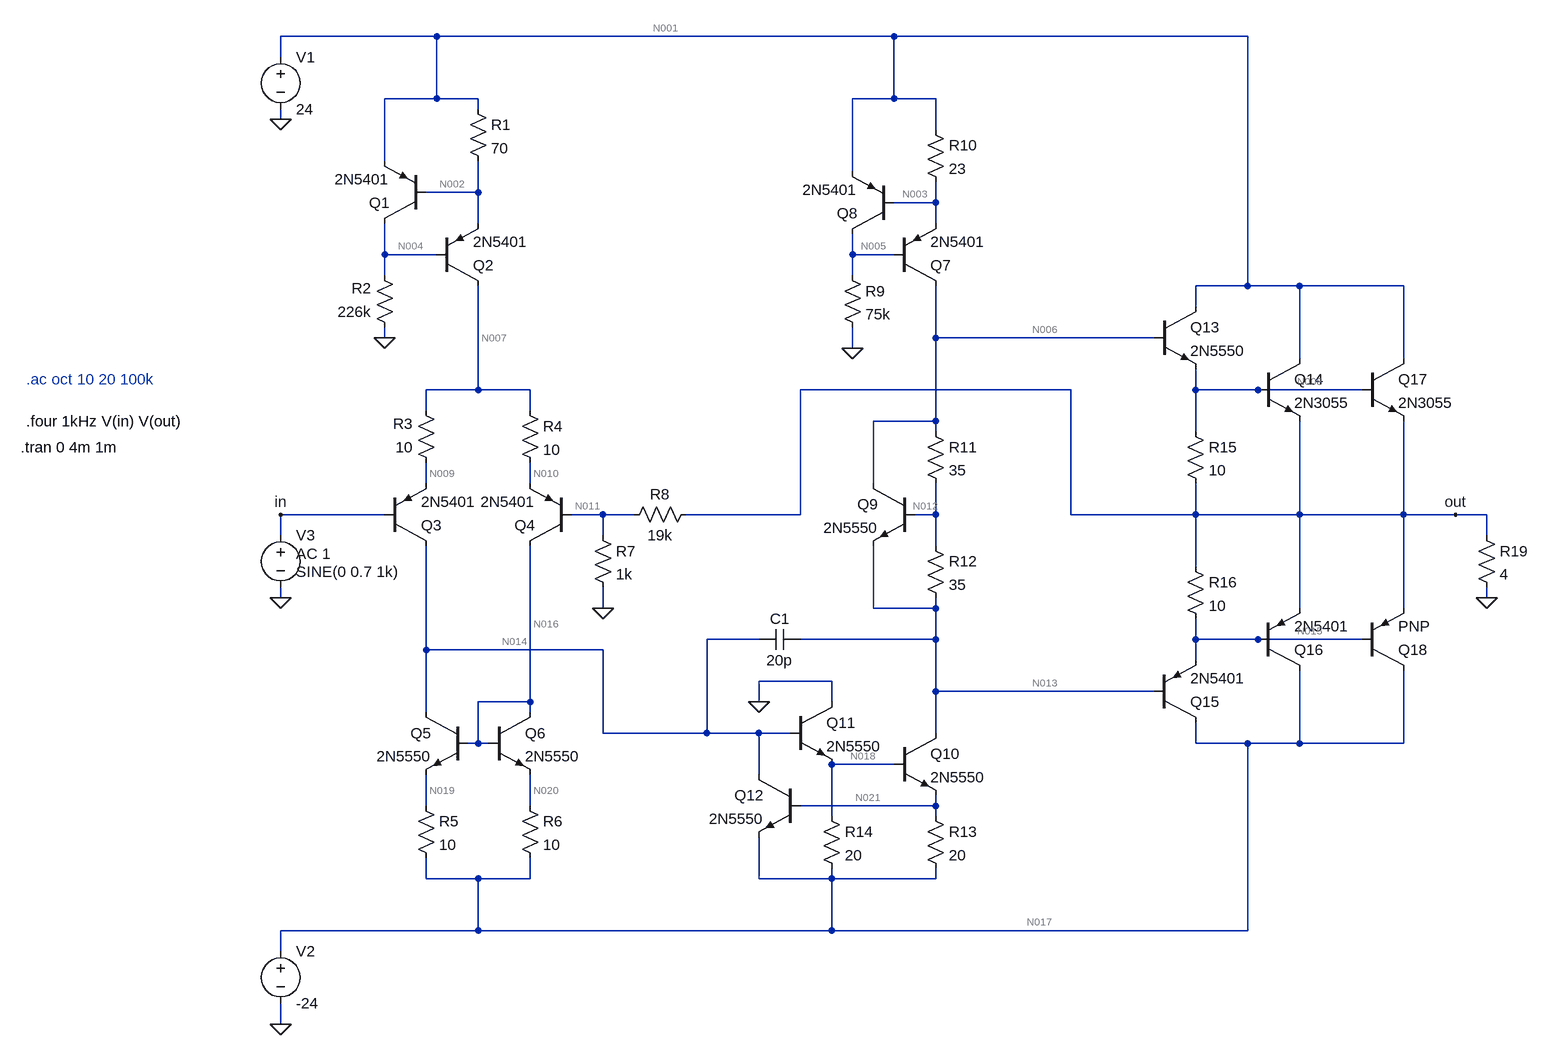
[diagram p0: schematic amp.asc]
amp.asc, the LTspice schematic file:
Version 4.1
SHEET 1 1880 1236
WIRE 96 -304 -144 -304
WIRE 800 -304 96 -304
WIRE 1344 -304 800 -304
WIRE -144 -272 -144 -304
WIRE 96 -208 96 -304
WIRE 96 -208 16 -208
WIRE 160 -208 96 -208
WIRE 800 -208 800 -304
WIRE 800 -208 736 -208
WIRE 864 -208 800 -208
WIRE 160 -192 160 -208
WIRE -144 -176 -144 -192
WIRE 864 -160 864 -208
WIRE 16 -112 16 -208
WIRE 736 -96 736 -208
WIRE 160 -64 160 -112
WIRE 160 -64 80 -64
WIRE 864 -48 864 -80
WIRE 864 -48 800 -48
WIRE 160 -16 160 -64
WIRE 864 -16 864 -48
WIRE 16 32 16 -16
WIRE 96 32 16 32
WIRE 736 32 736 0
WIRE 800 32 736 32
WIRE 16 64 16 32
WIRE 736 64 736 32
WIRE 1344 80 1344 -304
WIRE 1344 80 1264 80
WIRE 1424 80 1344 80
WIRE 1584 80 1424 80
WIRE 1264 112 1264 80
WIRE 16 160 16 144
WIRE 864 160 864 80
WIRE 1200 160 864 160
WIRE 736 176 736 144
WIRE 1424 192 1424 80
WIRE 1584 192 1584 80
WIRE 160 240 160 80
WIRE 160 240 80 240
WIRE 240 240 160 240
WIRE 1072 240 656 240
WIRE 1264 240 1264 208
WIRE 1360 240 1264 240
WIRE 1520 240 1360 240
WIRE 80 272 80 240
WIRE 240 272 240 240
WIRE 864 288 864 160
WIRE 864 288 768 288
WIRE 864 304 864 288
WIRE 1264 304 1264 240
WIRE 80 384 80 352
WIRE 240 384 240 352
WIRE 768 384 768 288
WIRE 16 432 -144 432
WIRE 352 432 304 432
WIRE 400 432 352 432
WIRE 656 432 656 240
WIRE 656 432 480 432
WIRE 864 432 864 384
WIRE 864 432 832 432
WIRE 1072 432 1072 240
WIRE 1264 432 1264 384
WIRE 1264 432 1072 432
WIRE 1424 432 1424 288
WIRE 1424 432 1264 432
WIRE 1584 432 1584 288
WIRE 1584 432 1424 432
WIRE 1664 432 1584 432
WIRE 1712 432 1664 432
WIRE -144 464 -144 432
WIRE 352 464 352 432
WIRE 1712 464 1712 432
WIRE 864 480 864 432
WIRE 1264 512 1264 432
WIRE -144 560 -144 544
WIRE 1712 560 1712 544
WIRE 352 576 352 544
WIRE 768 576 768 480
WIRE 864 576 864 560
WIRE 864 576 768 576
WIRE 1424 576 1424 432
WIRE 1584 576 1584 432
WIRE 592 624 512 624
WIRE 864 624 864 576
WIRE 864 624 656 624
WIRE 1264 624 1264 592
WIRE 1360 624 1264 624
WIRE 1520 624 1360 624
WIRE 80 640 80 480
WIRE 352 640 80 640
WIRE 1264 656 1264 624
WIRE 704 688 592 688
WIRE 864 704 864 624
WIRE 1200 704 864 704
WIRE 240 720 240 480
WIRE 240 720 160 720
WIRE 592 720 592 688
WIRE 704 720 704 688
WIRE 80 736 80 640
WIRE 240 736 240 720
WIRE 352 768 352 640
WIRE 512 768 512 624
WIRE 512 768 352 768
WIRE 592 768 512 768
WIRE 640 768 592 768
WIRE 864 768 864 704
WIRE 160 784 160 720
WIRE 160 784 144 784
WIRE 176 784 160 784
WIRE 1264 784 1264 752
WIRE 1344 784 1264 784
WIRE 1424 784 1424 672
WIRE 1424 784 1344 784
WIRE 1584 784 1584 672
WIRE 1584 784 1424 784
WIRE 800 816 704 816
WIRE 592 832 592 768
WIRE 80 880 80 832
WIRE 240 880 240 832
WIRE 864 880 864 864
WIRE 864 880 656 880
WIRE 704 896 704 816
WIRE 864 896 864 880
WIRE 80 992 80 960
WIRE 160 992 80 992
WIRE 240 992 240 960
WIRE 240 992 160 992
WIRE 592 992 592 928
WIRE 704 992 704 976
WIRE 704 992 592 992
WIRE 864 992 864 976
WIRE 864 992 704 992
WIRE 160 1072 160 992
WIRE 160 1072 -144 1072
WIRE 704 1072 704 992
WIRE 704 1072 160 1072
WIRE 1344 1072 1344 784
WIRE 1344 1072 704 1072
WIRE -144 1104 -144 1072
WIRE -144 1216 -144 1184
FLAG 16 160 0
FLAG 352 576 0
FLAG 736 176 0
FLAG 592 720 0
FLAG -144 -176 0
FLAG -144 1216 0
FLAG -144 560 0
FLAG 1712 560 0
FLAG 1664 432 out
FLAG -144 432 in
SYMBOL pnp 80 -16 R180
SYMATTR InstName Q1
SYMATTR Value 2N5401
SYMBOL res 144 -208 R0
SYMATTR InstName R1
SYMATTR Value 70
SYMBOL res 32 160 R180
WINDOW 0 36 76 Left 2
WINDOW 3 36 40 Left 2
SYMATTR InstName R2
SYMATTR Value 226k
SYMBOL res 96 368 R180
WINDOW 0 36 76 Left 2
WINDOW 3 36 40 Left 2
SYMATTR InstName R3
SYMATTR Value 10
SYMBOL res 224 256 R0
SYMATTR InstName R4
SYMATTR Value 10
SYMBOL pnp 16 480 M180
SYMATTR InstName Q3
SYMATTR Value 2N5401
SYMBOL pnp 304 480 R180
SYMATTR InstName Q4
SYMATTR Value 2N5401
SYMBOL npn 144 736 M0
SYMATTR InstName Q5
SYMATTR Value 2N5550
SYMBOL npn 176 736 R0
SYMATTR InstName Q6
SYMATTR Value 2N5550
SYMBOL res 64 864 R0
SYMATTR InstName R5
SYMATTR Value 10
SYMBOL res 224 864 R0
SYMATTR InstName R6
SYMATTR Value 10
SYMBOL res 336 448 R0
SYMATTR InstName R7
SYMATTR Value 1k
SYMBOL res 496 416 R90
WINDOW 0 0 56 VBottom 2
WINDOW 3 32 56 VTop 2
SYMATTR InstName R8
SYMATTR Value 19k
SYMBOL pnp 800 0 R180
SYMATTR InstName Q8
SYMATTR Value 2N5401
SYMBOL res 720 48 R0
SYMATTR InstName R9
SYMATTR Value 75k
SYMBOL res 848 -176 R0
SYMATTR InstName R10
SYMATTR Value 23
SYMBOL pnp 96 80 M180
SYMATTR InstName Q2
SYMATTR Value 2N5401
SYMBOL pnp 800 80 M180
SYMATTR InstName Q7
SYMATTR Value 2N5401
SYMBOL npn 832 384 M0
SYMATTR InstName Q9
SYMATTR Value 2N5550
SYMBOL res 848 288 R0
SYMATTR InstName R11
SYMATTR Value 35
SYMBOL res 848 464 R0
SYMATTR InstName R12
SYMATTR Value 35
SYMBOL npn 800 768 R0
SYMATTR InstName Q10
SYMATTR Value 2N5550
SYMBOL npn 640 720 R0
SYMATTR InstName Q11
SYMATTR Value 2N5550
SYMBOL npn 656 832 M0
SYMATTR InstName Q12
SYMATTR Value 2N5550
SYMBOL res 848 880 R0
SYMATTR InstName R13
SYMATTR Value 20
SYMBOL res 688 880 R0
SYMATTR InstName R14
SYMATTR Value 20
SYMBOL npn 1200 112 R0
SYMATTR InstName Q13
SYMATTR Value 2N5550
SYMBOL npn 1360 192 R0
SYMATTR InstName Q14
SYMATTR Value 2N3055
SYMBOL pnp 1200 752 M180
SYMATTR InstName Q15
SYMATTR Value 2N5401
SYMBOL pnp 1360 672 M180
SYMATTR InstName Q16
SYMATTR Value 2N5401
SYMBOL voltage -144 -288 R0
WINDOW 123 0 0 Left 0
WINDOW 39 0 0 Left 0
SYMATTR InstName V1
SYMATTR Value 24
SYMBOL voltage -144 1088 R0
WINDOW 123 0 0 Left 0
WINDOW 39 0 0 Left 0
SYMATTR InstName V2
SYMATTR Value -24
SYMBOL voltage -144 448 R0
WINDOW 3 24 72 Left 2
WINDOW 123 24 44 Left 2
WINDOW 39 0 0 Left 0
SYMATTR Value SINE(0 0.7 1k)
SYMATTR Value2 AC 1
SYMATTR InstName V3
SYMBOL res 1696 448 R0
SYMATTR InstName R19
SYMATTR Value 4
SYMBOL npn 1520 192 R0
SYMATTR InstName Q17
SYMATTR Value 2N3055
SYMBOL pnp 1520 672 M180
SYMATTR InstName Q18
SYMBOL res 1248 288 R0
SYMATTR InstName R15
SYMATTR Value 10
SYMBOL res 1248 496 R0
SYMATTR InstName R16
SYMATTR Value 10
SYMBOL cap 656 608 R90
WINDOW 0 0 32 VBottom 2
WINDOW 3 32 32 VTop 2
SYMATTR InstName C1
SYMATTR Value 20p
TEXT -536 224 Left 2 ;.ac oct 10 20 100k
TEXT -544 328 Left 2 !.tran 0 4m 1m
TEXT -536 288 Left 2 !.four 1kHz V(in) V(out)

The netlist it stands for:
* amp.asc
Q1 N004 N002 N001 0 2N5401
R1 N001 N002 70
R2 0 N004 226k
R3 N009 N007 10
R4 N007 N010 10
Q3 N014 in N009 0 2N5401
Q4 N016 N011 N010 0 2N5401
Q5 N014 N016 N019 0 2N5550
Q6 N016 N016 N020 0 2N5550
R5 N019 N017 10
R6 N020 N017 10
R7 N011 0 1k
R8 out N011 19k
Q8 N005 N003 N001 0 2N5401
R9 N005 0 75k
R10 N001 N003 23
Q2 N007 N004 N002 0 2N5401
Q7 N006 N005 N003 0 2N5401
Q9 N006 N012 N013 0 2N5550
R11 N006 N012 35
R12 N012 N013 35
Q10 N013 N018 N021 0 2N5550
Q11 0 N014 N018 0 2N5550
Q12 N014 N021 N017 0 2N5550
R13 N021 N017 20
R14 N018 N017 20
Q13 N001 N006 N008 0 2N5550
Q14 N001 N008 out 0 2N3055
Q15 N017 N013 N015 0 2N5401
Q16 N017 N015 out 0 2N5401
V1 N001 0 24
V2 N017 0 -24
V3 in 0 SINE(0 0.7 1k) AC 1
R19 out 0 4
Q17 N001 N008 out 0 2N3055
Q18 N017 N015 out 0 PNP
R15 N008 out 10
R16 out N015 10
C1 N013 N014 20p
.model NPN NPN
.model PNP PNP
.lib standard.bjt
* .ac oct 10 20 100k
.tran 0 4m 1m
.four 1kHz V(in) V(out)
.backanno
.end

* Results of the author's LTspice run, read from the files saved beside the schematic
* Operating Point, zero values left out:
*   V(n002) = 23.44 V
*   V(n009) = 667.5 mV
*   V(n007) = 708.9 mV
*   V(n014) = -21.91 V
*   V(n011) = 6.91 mV
*   V(n020) = -23.96 V
*   V(n017) = -24 V
*   V(n005) = 22.7 V
*   V(n012) = -1.088 V
*   V(n018) = -22.71 V
*   V(n015) = -1.063 V
*   V(n004) = 22.76 V
*   V(n001) = 24 V
*   V(n010) = 671.5 mV
*   V(n016) = -23.24 V
*   V(n019) = -23.96 V
*   V(out) = -355.1 mV
*   V(n003) = 23.42 V
*   V(n006) = -357.9 mV
*   V(n013) = -1.816 V
*   V(n021) = -23.48 V
*   V(n008) = -355.1 mV
*   I(R2) = -100.7 µA
*   Ic(Q12) = 1.197 µA
*   Ib(Q12) = 29.92 nA
*   Ie(Q12) = -1.227 µA
*   Ic(Q13) = 24.36 pA
*   Ib(Q13) = -24.36 pA
*   Ic(Q17) = 32.63 nA
*   Ib(Q17) = -8.934 nA
*   Ie(Q17) = -23.7 nA
*   I(R15) = 17.87 nA
*   Ic(Q1) = -45.25 µA
*   Ib(Q1) = -469.3 nA
*   Ie(Q1) = 45.72 µA
*   I(R6) = 3.681 mA
*   Ic(Q8) = -119.7 µA
*   Ib(Q8) = -1.162 µA
*   Ie(Q8) = 120.8 µA
*   Ic(Q9) = 4.197 mA
*   Ib(Q9) = 37.58 µA
*   Ie(Q9) = -4.235 mA
*   Ic(Q3) = -4.106 mA
*   Ib(Q3) = -28.98 µA
*   Ie(Q3) = 4.135 mA
*   I(V2) = 185.9 mA
*   I(R12) = 20.81 mA
*   I(R4) = 3.74 mA
*   Ic(Q5) = 3.668 mA
*   Ib(Q5) = 33.03 µA
*   Ie(Q5) = -3.701 mA
*   I(R8) = -19.06 µA
*   I(R10) = 25.23 mA
*   I(R14) = 64.48 mA
*   I(R19) = -88.79 mA
*   Ic(Q15) = -70.3 mA
*   Ib(Q15) = -600.4 µA
*   Ie(Q15) = 70.9 mA
*   I(R5) = 3.701 mA
*   Ic(Q14) = 32.63 nA
*   Ib(Q14) = -8.934 nA
*   Ie(Q14) = -23.7 nA
*   I(R9) = 302.7 µA
*   Ic(Q7) = -25.05 mA
*   Ib(Q7) = -183 µA
*   Ie(Q7) = 25.23 mA
*   I(R11) = 20.85 mA
*   I(R1) = 7.93 mA
*   Ic(Q4) = -3.714 mA
*   Ib(Q4) = -25.97 µA
*   Ie(Q4) = 3.74 mA
*   Ic(Q11) = 64.22 mA
*   Ib(Q11) = 436.9 µA
*   Ie(Q11) = -64.65 mA
*   I(V1) = -33.33 mA
*   Ic(Q18) = -76.5 µA
*   Ib(Q18) = -765 nA
*   Ie(Q18) = 77.27 µA
*   I(R13) = 25.82 mA
*   Ic(Q16) = -17.83 mA
*   Ib(Q16) = -127.5 µA
*   Ie(Q16) = 17.95 mA
*   I(R3) = -4.135 mA
*   I(R7) = 6.91 µA
*   Ic(Q2) = -7.875 mA
*   Ib(Q2) = -55.46 µA
*   Ie(Q2) = 7.931 mA
*   Ic(Q6) = 3.648 mA
*   Ib(Q6) = 33.26 µA
*   Ie(Q6) = -3.681 mA
*   Ic(Q10) = 25.65 mA
*   Ib(Q10) = 174.2 µA
*   Ie(Q10) = -25.82 mA
*   I(V3) = 28.98 µA
*   I(R16) = 70.77 mA
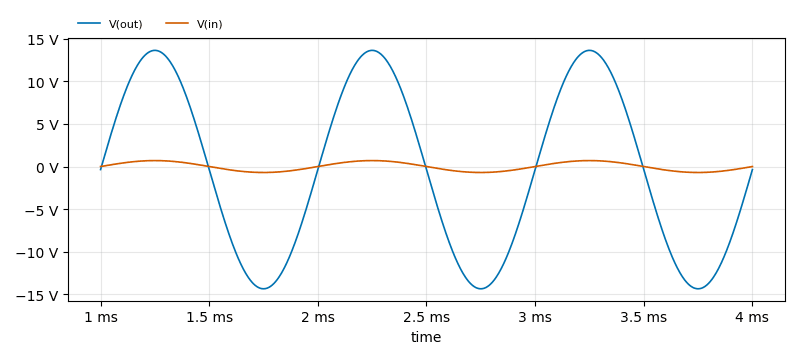
[diagram p1: Transient Analysis of amp.asc, plotted from the saved traces]
* Transient Analysis, 1 run:
*   V(out): min -14.35 V, max 13.64 V, average -356.3 mV, rms 9.902 V, last -355.8 mV
*   V(in): min -700 mV, max 700 mV, average -265.6 nV, rms 495 mV, last 0 V
* From the log:
*   Fourier components of V(in)
*   N-Period=1
*   DC component:1.75119e-08
*   Harmonic  Frequency   Fourier   Normalized   Phase    Normalized
*    Number     [Hz]     Component   Component  [degree]  Phase [deg]
*       1      1.000e+03   7.000e-01   1.000e+00     90.00°      0.00°
*       2      2.000e+03   2.783e-08   3.976e-08     35.43°    -54.57°
*       3      3.000e+03   2.003e-07   2.862e-07     86.46°     -3.54°
*       4      4.000e+03   2.474e-08   3.534e-08     83.93°     -6.07°
*       5      5.000e+03   3.273e-07   4.676e-07     92.62°      2.62°
*       6      6.000e+03   5.055e-08   7.222e-08    138.24°     48.24°
*       7      7.000e+03   4.469e-07   6.385e-07     97.04°      7.04°
*       8      8.000e+03   9.595e-08   1.371e-07    160.20°     70.20°
*       9      9.000e+03   5.577e-07   7.968e-07    100.99°     10.99°
*   Partial Harmonic Distortion: 0.000117%
*   Total Harmonic Distortion:   0.000000%
*   Fourier components of  V(out)
*   N-Period=1
*   DC component:-0.356316
*   Harmonic  Frequency   Fourier   Normalized   Phase    Normalized
*    Number     [Hz]     Component   Component  [degree]  Phase [deg]
*       1      1.000e+03   1.399e+01   1.000e+00     90.00°      0.00°
*       2      2.000e+03   2.349e-04   1.678e-05     -8.76°    -98.76°
*       3      3.000e+03   5.356e-04   3.827e-05    -94.81°   -184.81°
*       4      4.000e+03   1.136e-04   8.117e-06   -175.69°   -265.69°
*       5      5.000e+03   4.853e-04   3.468e-05    -95.96°   -185.97°
*       6      6.000e+03   3.974e-05   2.839e-06   -168.21°   -258.21°
*       7      7.000e+03   3.320e-04   2.372e-05    -98.53°   -188.54°
*       8      8.000e+03   1.969e-05   1.407e-06   -156.32°   -246.32°
*       9      9.000e+03   2.461e-04   1.758e-05   -101.41°   -191.41°
*   Partial Harmonic Distortion: 0.006243%
*   Total Harmonic Distortion:   0.000000%